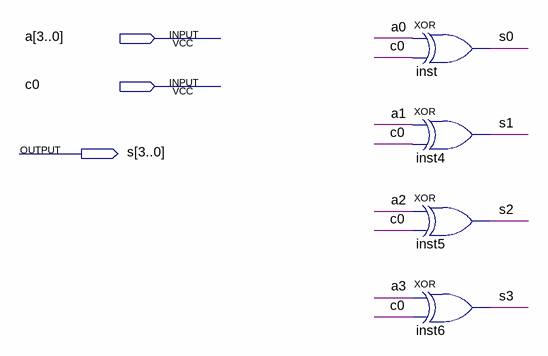
[diagram p0: schematic sheet]
// Quartus schematic mbr_xor2_4b.bdf as structural Verilog: 4 symbols, 3 pins
module mbr_xor2_4b (
  input  [3:0] a,
  input  c0,
  output [3:0] s
);

  xor inst (s[0], a[0], c0);
  xor inst4 (s[1], a[1], c0);
  xor inst5 (s[2], a[2], c0);
  xor inst6 (s[3], a[3], c0);
endmodule
